# Altium schematic sheet SQUIDCtrl_Rev0.SchDoc
size A4
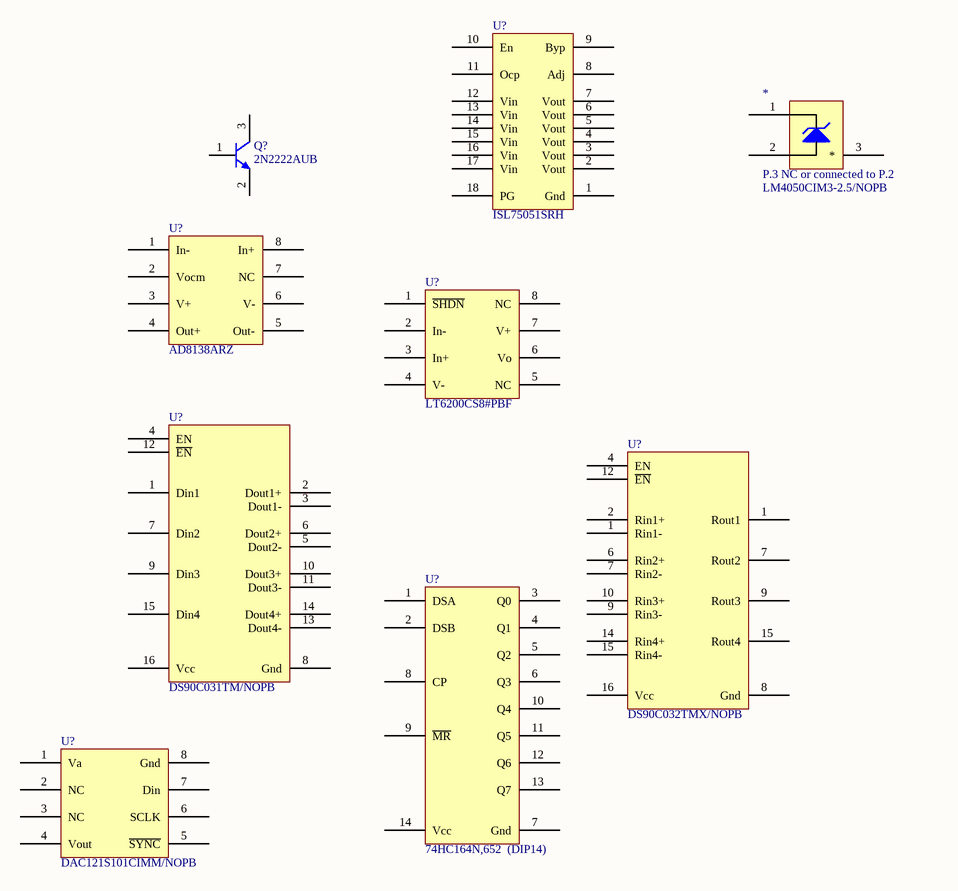
[diagram p0: SQUIDCtrl_Rev0.SchDoc]

## Parts
(Parts that share a designator on the sheet are numbered #1, #2 ... from top to bottom, then left to right.)
*  LM4050CIM3-2.5/NOPB
Q?  2N2222AUB  [2N2222AUB]
U?#1  ISL75051SRH
U?#2  AD8138ARZ  [SO8]
U?#3  LT6200CS8#PBF  [SO8]
U?#4  DS90C031TM/NOPB  [SO16]
U?#5  DS90C032TMX/NOPB  [SO16]
U?#6  74HC164N,652  (DIP14)
U?#7  DAC121S101CIMM/NOPB  [MSOP-8]

## Nets

Not connected (* = marked no-connect by the designer): * 1(+) 2(-) 3(*); Q? 1(B) 2(E) 3(C); U?#1 1(Gnd) 2(Vout) 3(Vout) 4(Vout) 5(Vout) 6(Vout) 7(Vout) 8(Adj) 9(Byp) 10(En) 11(Ocp) 12(Vin) 13(Vin) 14(Vin) 15(Vin) 16(Vin) 17(Vin) 18(PG); U?#2 1(In-) 2(Vocm) 3(V+) 4(Out+) 5(Out-) 6(V-) 7(NC) 8(In+); U?#3 1(~{SHDN}) 2(In-) 3(In+) 4(V-) 5(NC) 6(Vo) 7(V+) 8(NC); U?#4 1(Din1) 2(Dout1+) 3(Dout1-) 4(EN) 5(Dout2-) 6(Dout2+) 7(Din2) 8(Gnd) 9(Din3) 10(Dout3+) 11(Dout3-) 12(~{EN}) 13(Dout4-) 14(Dout4+) 15(Din4) 16(Vcc); U?#5 1(Rout1) 2(Rin1+) 4(EN) 6(Rin2+) 7(Rin2-) 8(Gnd) 9(Rout3) 10(Rin3+) 12(~{EN}) 14(Rin4+) 15(Rin4-) 16(Vcc); U?#6 1(DSA) 2(DSB) 3(Q0) 4(Q1) 5(Q2) 6(Q3) 7(Gnd) 8(CP) 9(~{MR}) 10(Q4) 11(Q5) 12(Q6) 13(Q7) 14(Vcc); U?#7 1(Va) 2(NC) 3(NC) 4(Vout) 5(~{SYNC}) 6(SCLK) 7(Din) 8(Gnd)

## Notes on the sheet
- (in symbol LM4050CIM3-2.5/NOPB) P.3 NC or connected to P.2

## Library data of the parts
* = LM4050CIM3-2.5/NOPB: IC VREF SHUNT PREC 2.5V SOT-23-3; Manufacturer: National Semiconductor; Reference Type: Shunt, Precision; Tolerance: ±0.5%; Temperature Coefficient: 50ppm/°C; Number of Channels: 1; Current - Cathode: 65µA; Current - Output: 15mA; Supplier 1: Digi-Key; Manufacturer Part Number: LM4050CIM3-2.5/NOPB; RoHS: RoHS Compliant; Category: Integrated Circuits (ICs); Stock 1: 2606; Pricing 1: 1=2.78, 25=2.144, 100=1.9456, 250=1.74704, 500=1.5088 (CAD); Voltage - Output: 2.5V; Voltage - Input: -; Current - Quiescent: -; Operating Temperature: -40°C ~ 85°C; Mounting Type: Surface Mount; Package / Case: TO-236-3, SC-59, SOT-23-3; Supplier Device Package: SOT-23-3; Packaging: Digi-Reel®; ComponentLink1URL: http://www.ti.com/lit/ds/symlink/lm4050-n.pdf; ComponentLink1Description: http://www.ti.com/lit/ds/symlink/lm4050-n.pdf
Q? = 2N2222AUB: Trans GP BJT NPN 50V 0.8A 3-Pin UB; Manufacturer: Microsemi; Lead Time: 16 weeks; Supplier 1: Arrow; Manufacturer Part Number: 2N2222AUB; RoHS: CHINA ROHS: Not Compliant / EU ROHS: Not Compliant; Stock 1: 0; Pricing 1: 0=11.11 (USD); Package Quantity: 1; Termination Finish: SnPb; EU_ROHS_PROD_EXEMPTION_BY_SUPP: N/R; ComponentLink1URL: http://components.arrow.com/partservice/dataview/altium/5274365S6519402N9770?apiKey=aa438727d59eed98c4bed826d8d949c84cb5e685b92bf87346a0226bd2658797; ComponentLink1Description: http://components.arrow.com/partservice/dataview/altium/5274365S6519402N9770?apiKey=aa438727d59eed98c4bed826d8d949c84cb5e685b92bf87346a0226bd2658797
U?#1 = ISL75051SRH: 3A, Rad Hard, Positive, Ultra Low Dropout Regulator
U?#2 = AD8138ARZ: IC AMP DIFF LDIST LP 95MA 8SOIC; Manufacturer: Analog Devices Inc; Supplier 1: Digi-Key; Manufacturer Part Number: AD8138ARZ; RoHS: RoHS Compliant; Category: Integrated Circuits (ICs); Stock 1: 1339; Pricing 1: 1=9.41, 25=7.7196, 100=6.9662, 250=6.40144, 500=5.83662, 1000=5.0835, 2500=4.89522, 5000=4.74211 (CAD); Type: ADC Driver; Applications: Data Acquisition; Mounting Type: Surface Mount; Package / Case: 8-SOIC (0.154", 3.90mm Width); Supplier Device Package: 8-SOIC; Packaging: Tube; ComponentLink1URL: http://www.analog.com/static/imported-files/data_sheets/AD8138.pdf; ComponentLink1Description: http://www.analog.com/static/imported-files/data_sheets/AD8138.pdf
U?#3 = LT6200CS8#PBF: IC OPAMP R-R I/O 165MHZ 8-SOIC; Manufacturer: Linear Technology; Amplifier Type: Buffer; Number of Circuits: 1; Output Type: Rail-to-Rail; Slew Rate: 50 V/µs; Current - Input Bias: 23µA; Voltage - Input Offset: 2500µV; Current - Supply: 20mA; Current - Output / Channel: 90mA; Voltage - Supply, Single/Dual (±): 2.5 V ~ 12.6 V, ±1.25 V ~ 6.3 V; Supplier 1: Digi-Key; Manufacturer Part Number: LT6200CS8#PBF; RoHS: RoHS Compliant; Category: Integrated Circuits (ICs); Stock 1: 1263; Pricing 1: 1=4.72, 25=3.1288, 100=2.572 (CAD); Gain Bandwidth Product: 165MHz; -3db Bandwidth: -; Operating Temperature: 0°C ~ 70°C; Mounting Type: Surface Mount; Package / Case: 8-SOIC (0.154", 3.90mm Width); Supplier Device Package: 8-SO; Packaging: Tube; ComponentLink1URL: http://www.linear.com/docs/3869; ComponentLink1Description: http://www.linear.com/docs/3869
U?#4 = DS90C031TM/NOPB: IC LINE DRVR LVDS QUAD 16-SOIC; Manufacturer: National Semiconductor; Number of Drivers/Receivers: 4/0; Voltage - Supply: 4.5 V ~ 5.5 V; Supplier 1: Digi-Key; Manufacturer Part Number: DS90C031TM/NOPB; RoHS: RoHS Compliant; Category: Integrated Circuits (ICs); Stock 1: 1891; Pricing 1: 1=3.12, 25=2.5076, 100=2.2848, 250=2.06188, 500=1.85012, 1000=1.56034, 2500=1.48232, 5000=1.42102, 10000=1.38202 (CAD); Type: Driver; Protocol: LVDS; Mounting Type: Surface Mount; Package / Case: 16-SOIC (0.154", 3.90mm Width); Supplier Device Package: 16-SOIC N; Packaging: Tube; ComponentLink1URL: http://www.ti.com/lit/ds/symlink/ds90c031.pdf; ComponentLink1Description: http://www.ti.com/lit/ds/symlink/ds90c031.pdf
U?#5 = DS90C032TMX/NOPB: IC LINE DRVR LVDS QUAD 16-SOIC; Manufacturer: National Semiconductor; Description: IC LINE RCVR LVDS QUAD 16-SOIC; Number of Drivers/Receivers: 0/4; Voltage - Supply: 4.5 V ~ 5.5 V; Supplier 1: Digi-Key; Manufacturer Part Number: DS90C032TMX/NOPB; RoHS: RoHS Compliant; Category: Integrated Circuits (ICs); Stock 1: 7314; Pricing 1: 1=3.23, 25=2.4884, 100=2.258, 250=2.0276, 500=1.7511, 1000=1.47461 (CAD); Type: Receiver; Protocol: LVDS; Mounting Type: Surface Mount; Package / Case: 16-SOIC (0.154", 3.90mm Width); Supplier Device Package: 16-SOIC N; Packaging: Cut Tape (CT); ComponentLink1URL: http://www.ti.com/lit/ds/symlink/ds90c032.pdf; ComponentLink1Description: http://www.ti.com/lit/ds/symlink/ds90c032.pdf
U?#6 = 74HC164N,652: IC 8BIT SHIFT REGISTER 14-DIP; Manufacturer: NXP Semiconductors; Output Type: Standard; Number of Elements: 1; Number of Bits per Element: 8; Function: Serial to Parallel; Voltage - Supply: 2 V ~ 6 V; Supplier 1: Digi-Key; Manufacturer Part Number: 74HC164N,652; RoHS: RoHS Compliant; Category: Integrated Circuits (ICs); Stock 1: 1945; Pricing 1: 1=0.48, 10=0.407, 25=0.3564, 100=0.3054, 250=0.26472, 500=0.22398, 1000=0.17307, 2500=0.1578, 5000=0.14762 (CAD); Logic Type: Shift Register; Operating Temperature: -40°C ~ 125°C; Mounting Type: Through Hole; Package / Case: 14-DIP (0.300", 7.62mm); Supplier Device Package: 14-DIP; Packaging: Tube; ComponentLink1URL: http://www.nxp.com/documents/data_sheet/74HC_HCT164.pdf; ComponentLink1Description: http://www.nxp.com/documents/data_sheet/74HC_HCT164.pdf
U?#7 = DAC121S101CIMM/NOPB: CONV D/A 12BIT MICROPWR 8MSOP; Manufacturer: National Semiconductor; Settling Time: 12µs; Number of Bits: 12; Data Interface: DSP, MICROWIRE™, QSPI™, Serial, SPI™; Number of Converters: 1; Voltage Supply Source: Single Supply; Power Dissipation (Max): 1.72mW; Number of Outputs and Type: 1 Voltage, Unipolar; 1 Voltage, Bipolar; Supplier 1: Digi-Key; Manufacturer Part Number: DAC121S101CIMM/NOPB; RoHS: RoHS Compliant; Category: Integrated Circuits (ICs); Stock 1: 3011; Pricing 1: 1=3.5, 25=2.8616, 100=2.5698, 250=2.33624, 500=2.0442 (CAD); Operating Temperature: -40°C ~ 105°C; Mounting Type: Surface Mount; Package / Case: 8-TSSOP, 8-MSOP (0.118", 3.00mm Width); Supplier Device Package: 8-MSOP; Packaging: Cut Tape (CT); Sampling Rate (Per Second): *; ComponentLink1URL: http://www.ti.com/lit/ds/symlink/dac121s101.pdf; ComponentLink1Description: http://www.ti.com/lit/ds/symlink/dac121s101.pdf